# Altium schematic sheet Supply.SchDoc: Supply
size 420 x 297 mm; DocumentNumber: 9; SheetNumber: 6; SheetTotal: 15
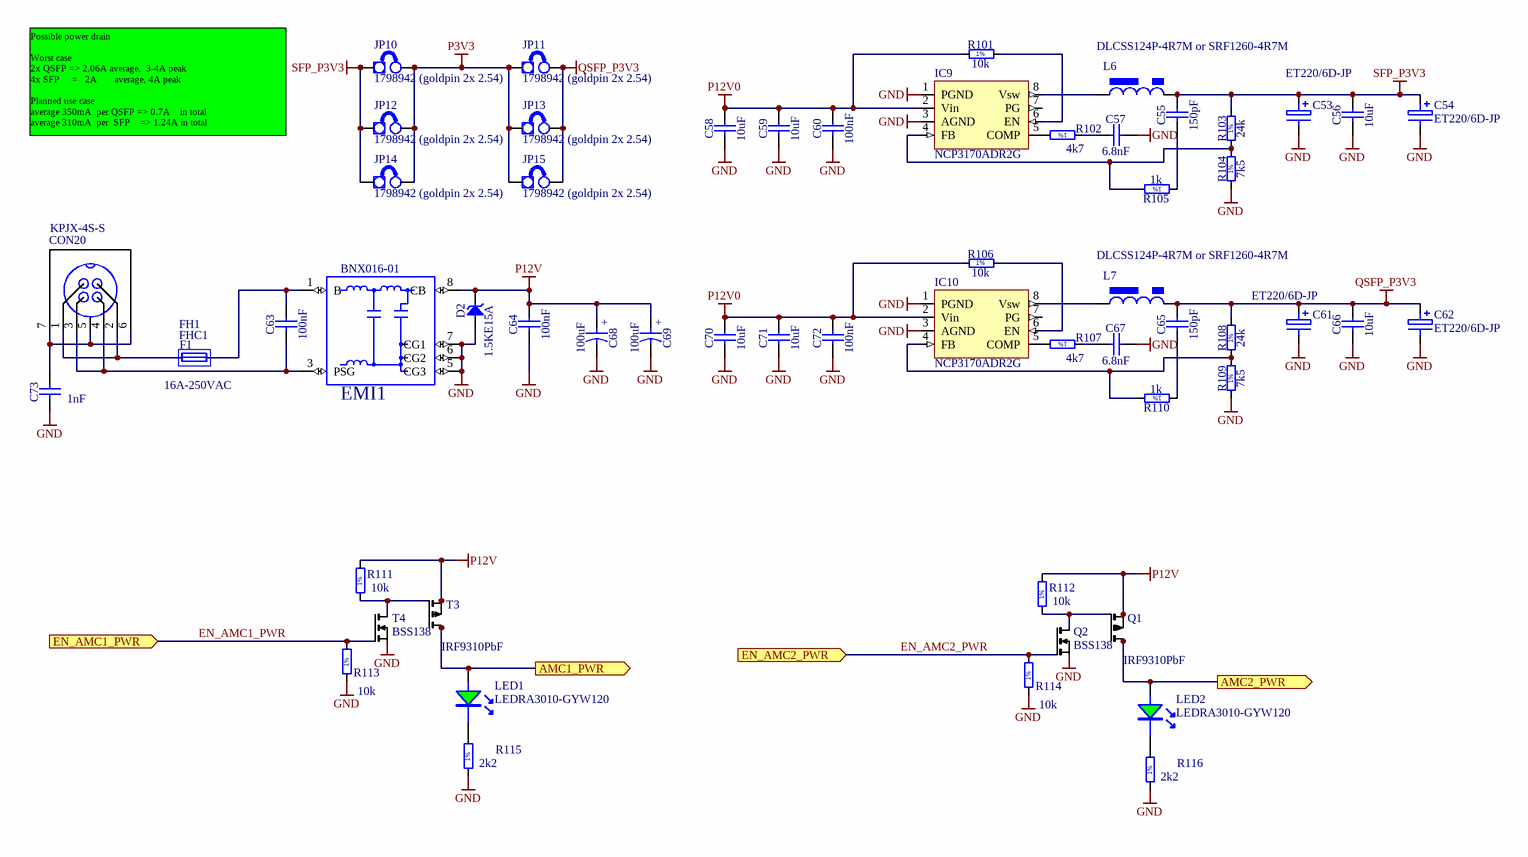
[diagram p0: Supply.SchDoc]

## Parts
C53  ET220/6D-JP  [2917_SMDD]
C54  ET220/6D-JP  [2917_SMDD]
C55  150pF  [CAPC1608X87N]
C56  10uF  [CAPC2012X135N]
C57  6.8nF  [CAPC1608X87N]
C58  10uF  [CAPC3216X140N]
C59  10uF  [CAPC3216X140N]
C60  100nF  [CAPC1005X55N]
C61  ET220/6D-JP  [2917_SMDD]
C62  ET220/6D-JP  [2917_SMDD]
C63  100nF  [CAPC1005X55N]
C64  100nF  [CAPC1005X55N]
C65  150pF  [CAPC1608X87N]
C66  10uF  [CAPC2012X135N]
C67  6.8nF  [CAPC1608X87N]
C68  100uF  [CAPMP7343X430N]
C69  100uF  [CAPMP7343X430N]
C70  10uF  [CAPC3216X140N]
C71  10uF  [CAPC3216X140N]
C72  100nF  [CAPC1005X55N]
C73  1nF  [CAPC3216X140N]
CON20  KPJX-4S-S  [CON_KPJX-4S-S]
D2  1.5KE15A  [VISHAY_1.5KE]
EMI1  BNX016-01  [BNX016-01]
F1  16A-250VAC  [FUSE_5X20_GLASS_h]
FH1  Fuse Holder  [FUSH_SCHURTER_OGN]  (value not drawn)
FHC1  Fuse Holder Cover No Pin  [FUSHC_SCHURTER_0853.0551]  (value not drawn)
IC9  NCP3170ADR2G  [so-8]
IC10  NCP3170ADR2G  [so-8]
JP10  1798942 (goldpin 2x 2.54)  [HEADER2x1 2.54mm]
JP11  1798942 (goldpin 2x 2.54)  [HEADER2x1 2.54mm]
JP12  1798942 (goldpin 2x 2.54)  [HEADER2x1 2.54mm]
JP13  1798942 (goldpin 2x 2.54)  [HEADER2x1 2.54mm]
JP14  1798942 (goldpin 2x 2.54)  [HEADER2x1 2.54mm]
JP15  1798942 (goldpin 2x 2.54)  [HEADER2x1 2.54mm]
L6  DLCSS124P-4R7M or SRF1260-4R7M  [choke_DLCSS124]
L7  DLCSS124P-4R7M or SRF1260-4R7M  [choke_DLCSS124]
LED1  LEDRA3010-GYW120  [LED_KPA3010_G]
LED2  LEDRA3010-GYW120  [LED_KPA3010_G]
Q1  IRF9310PbF  [so-8]
Q2  BSS138  [SOT95P251X112-3N]
R101  10k  [RESC1005X40N]
R102  4k7  [RESC1005X40N]
R103  24k  [RESC1608X55N]
R104  7k5  [RESC1608X55N]
R105  1k  [RESC1005X40N]
R106  10k  [RESC1005X40N]
R107  4k7  [RESC1005X40N]
R108  24k  [RESC1608X55N]
R109  7k5  [RESC1608X55N]
R110  1k  [RESC1005X40N]
R111  10k  [RESC1005X40N]
R112  10k  [RESC1005X40N]
R113  10k  [RESC1005X40N]
R114  10k  [RESC1005X40N]
R115  2k2  [RESC1005X40N]
R116  2k2  [RESC1005X40N]
T3  IRF9310PbF  [so-8]
T4  BSS138  [SOT95P251X112-3N]

## Ports
AMC1_PWR (out), AMC2_PWR (out), EN_AMC1_PWR (in), EN_AMC2_PWR (in)

## Nets
GND: C53.2 C54.2 C56.1 C57.2 C58.1 C59.1 C60.1 C61.2 C62.2 C64.1 C66.1 C67.2 C68.2 C69.2 C70.1 C71.1 C72.1 C73.1 D2.2(A) EMI1.5(CG3) EMI1.6(CG2) EMI1.7(CG1) IC9.1(PGND) IC9.3(AGND) IC10.1(PGND) IC10.3(AGND) Q2.2(S) R104.1 R109.1 R113.1 R114.1 R115.1 R116.1 T4.2(S)
P3V3: JP10.2(E2) JP11.1(E1) JP12.2(E2) JP13.1(E1) JP14.2(E2) JP15.1(E1)
P12V: C64.2 C68.1 C69.1 D2.1(C) EMI1.8(CB) Q1.1(S1) Q1.2(S1) Q1.3(S1) R111.2 R112.2 T3.1(S1) T3.2(S1) T3.3(S1)
P12V0: C58.2 C59.2 C60.2 C70.2 C71.2 C72.2 IC9.2(Vin) IC10.2(Vin) R101.1 R106.1
QSFP_P3V3: C61.1 C62.1 C65.2 C66.2 JP11.2(E2) JP13.2(E2) JP15.2(E2) L7.2 R108.2
SFP_P3V3: C53.1 C54.1 C55.2 C56.2 JP10.1(E1) JP12.1(E1) JP14.1(E1) L6.2 R103.2
AMC1_PWR: LED1.A T3.5(D1) T3.6(D1) T3.7(D1) T3.8(D1) ; port AMC1_PWR
AMC2_PWR: LED2.A Q1.5(D1) Q1.6(D1) Q1.7(D1) Q1.8(D1) ; port AMC2_PWR
EN_AMC1_PWR: R113.2 T4.1(G) ; port EN_AMC1_PWR
EN_AMC2_PWR: Q2.1(G) R114.2 ; port EN_AMC2_PWR
NetC55_1: C55.1 R105.1
NetC57_1: C57.1 R102.1
NetC63_1: C63.1 CON20.3 CON20.4 EMI1.3(PSG)
NetC63_2: C63.2 EMI1.1(B) FH1.2
NetC65_1: C65.1 R110.1
NetC67_1: C67.1 R107.1
NetC73_2: C73.2 CON20.5 CON20.6 CON20.7
NetCON20_1: CON20.1 CON20.2 FH1.1
NetIC9_4: IC9.4(FB) R103.1 R104.2 R105.2
NetIC9_5: IC9.5(COMP) R102.2
NetIC9_6: IC9.6(EN) R101.2
NetIC9_8: IC9.8(Vsw) L6.1
NetIC10_4: IC10.4(FB) R108.1 R109.2 R110.2
NetIC10_5: IC10.5(COMP) R107.2
NetIC10_6: IC10.6(EN) R106.2
NetIC10_8: IC10.8(Vsw) L7.1
NetLED1_K: LED1.K R115.2
NetLED2_K: LED2.K R116.2
NetQ1_4: Q1.4(G1) Q2.3(D) R112.1
NetR111_1: R111.1 T3.4(G1) T4.3(D)

Not connected (* = marked no-connect by the designer): IC9 7(PG); IC10 7(PG)

## Notes on the sheet
- Possible power drain
  Worst case
  2x QSFP => 2.06A average,  3-4A peak
  4x SFP     =   2A       average, 4A peak
  Planned use case
  average 350mA  per QSFP => 0.7A    in total
  average 310mA  per  SFP    => 1.24A in total
- Project/Equipment
- Document
- uTCA RTM 8 SFP+
- Designer
- Drawn by
- Check.by
- Copyright Creotech Instruments SA 2014.
  This documentation describes Open Hardware and is licensed under the CERN OHL v.1.1. You may redistribute and modify this documentation under the terms of the CERN OHL v.1.1. (http://ohwr.org/CERNOHL). This documentation is distributed WITHOUT ANY EXPRESS OR IMPLIED WARRANTY, INCLUDING OF MERCHANTABILITY, SATISFACTORY QUALITY AND FITNESS FOR A PARTICULAR PURPOSE. Please see the CERN OHL v.1.1 for applicable conditions.
- Creotech Instruments S.A.
- File
- Last Mod.
- Print Date
- Sheet
- Size
- A3
- of
- Rev
- (in symbol CTE7343-43_100UF_20V_10%_LESR0150) +
- (in symbol R0402_1K_1%_0.0625W_100PPM) 1%
- (in symbol R0402_2K2_1%_0.0625W_100PPM) 1%
- (in symbol R0402_4K7_1%_0.0625W_100PPM) 1%
- (in symbol R0402_10K_1%_0.0625W_100PPM) 1%
- (in symbol R0603_7K5_1%_0.1W_100PPM) 1%
- (in symbol R0603_24K_1%_0.1W_100PPM) 1%

## Library data of the parts
C53 C54 C61 C62 = CAP_TANTALIUM: Tantalium Capacitor
C55 C65 = CC0603_150PF_50V_5%_NP0: Non-polarised capacitor; Part Description: SMD Multilayer Chip Ceramic Capacitor; Manufacturer: GENERIC; Manufacturer1 Part Number: 223886715151; Voltage: 50V; TC: NP0; Tolerance: ±5%; Table: Capacitors SMD; Part Number: CC0603_150PF_50V_5%_NP0; Component Kind: Standard; Component Type: Standard; Pin Count: 2; Value: 150pF; Status: Preferred; Manufacturer Part Number: CC0603_150PF_50V_5%_NP0; Case: 0603; Mounted: Yes; Socket: No; SMD: Yes; Manufacturer1 Example: PHYCOMP; Manufacturer1 ComponentHeight: 0.87mm; HelpURL: \\cern.ch\dfs\Applications\Altium\Datasheets\CC0603_NP0_PHYCOMP.pdf; Author: CERN DEM JLC; CreateDate: 2007-12-03; LatestRevisionDate: 2007-12-03
C56 C66 = CC0805_10UF_10V_10%_X7R: Non-polarised capacitor; Part Description: SMD Multilayer Chip Ceramic Capacitor; Manufacturer: GENERIC; Manufacturer1 Part Number: GRM21BR71A106KE51L; Voltage: 10V; TC: X7R; Tolerance: ±10%; Table: Capacitors SMD; Part Number: CC0805_10UF_10V_10%_X7R; Component Kind: Standard; Component Type: Standard; Pin Count: 2; Value: 10uF; Status: Preferred; Manufacturer Part Number: CC0805_10UF_10V_10%_X7R; Case: 0805; Mounted: Yes; Socket: No; SMD: Yes; Manufacturer1 Example: MURATA; Manufacturer1 ComponentHeight: 1.35mm; HelpURL: \\cern.ch\dfs\Applications\Altium\Datasheets\CC0805_X7R_MURATA.pdf; Author: CERN DEM JLC; CreateDate: 2012-04-30; LatestRevisionDate: 2012-04-30
C57 C67 = CC0603_6.8NF_50V_5%_C0G: Non-polarised capacitor; Part Description: SMD Multilayer Chip Ceramic Capacitor; Manufacturer: GENERIC; Manufacturer1 Part Number: C0603C682J5GACTU; Voltage: 50V; TC: C0G; Tolerance: ±5%; Table: Capacitors SMD; Part Number: CC0603_6.8NF_50V_5%_C0G; Component Kind: Standard; Component Type: Standard; Pin Count: 2; Value: 6.8nF; Status: Preferred; Manufacturer Part Number: CC0603_6.8NF_50V_5%_C0G; Case: 0603; Mounted: Yes; Socket: No; SMD: Yes; Manufacturer1 Example: KEMET; Manufacturer1 ComponentHeight: 0.87mm; HelpURL: \\cern.ch\dfs\Applications\Altium\Datasheets\CC0603_C0G_KEMET.pdf; Author: CERN DEM JLC; CreateDate: 2013-10-01; LatestRevisionDate: 2013-10-01
C58 C59 C70 C71 = CC1206_10UF_16V_10%_X7R: Non-polarised capacitor; Part Description: SMD Multilayer Chip Ceramic Capacitor; Manufacturer: GENERIC; Manufacturer1 Part Number: C1206C106K4RAC; Voltage: 16V; TC: X7R; Tolerance: ±10%; Table: Capacitors SMD; Part Number: CC1206_10UF_16V_10%_X7R; Component Kind: Standard; Component Type: Standard; Pin Count: 2; Value: 10uF; Status: Preferred; Manufacturer Part Number: CC1206_10uF_16V_10%_X7R; Case: 1206; Mounted: Yes; Socket: No; SMD: Yes; Manufacturer1 Example: KEMET; Manufacturer1 ComponentHeight: 1.8mm; HelpURL: \\cern.ch\dfs\Applications\Altium\Datasheets\CC1206_X7R_KEMET.pdf; Author: CERN DEM JLC; CreateDate: 2009-04-28; LatestRevisionDate: 2009-04-28
C60 C63 C64 C72 = CC0402_100NF_16V_10%_X5R: Non-polarised capacitor; Part Description: SMD Multilayer Chip Ceramic Capacitor; Manufacturer: GENERIC; Manufacturer1 Part Number: GRM155R61C104KA88D; Voltage: 16V; TC: X5R; Tolerance: ±10%; Table: Capacitors SMD; Part Number: CC0402_100NF_16V_10%_X5R; Component Kind: Standard; Component Type: Standard; Pin Count: 2; Value: 100nF; Status: None; Manufacturer Part Number: CC0402_100NF_16V_10%_X5R; Case: 0402; Mounted: Yes; Socket: No; SMD: Yes; Manufacturer1 Example: MURATA; Manufacturer1 ComponentHeight: 0.55mm; HelpURL: \\cern.ch\dfs\Applications\Altium\Datasheets\CC0402_X5R_MURATA_GRM.pdf; Author: CERN DEM JLC; CreateDate: 2013-12-10; LatestRevisionDate: 2013-12-10
C68 C69 = CTE7343-43_100UF_20V_10%_LESR0150: Polarised capacitor; Part Description: Low ESR 0R15 Solid Tantalum Chip Capacitor; Manufacturer: GENERIC; Manufacturer1 Part Number: TPSE107K020R0150; Voltage: 20V; Tolerance: ±10%; Table: Capacitors SMD; Part Number: CTE7343-43_100UF_20V_10%_LESR0150; Component Kind: Standard; Component Type: Standard; Pin Count: 2; Value: 100uF; Status: Preferred; Manufacturer Part Number: CTE7343-43_100UF_20V_10%_LESR0150; Case: E; Mounted: Yes; Socket: No; SMD: Yes; Manufacturer1 Example: AVX; Manufacturer1 ComponentHeight: 4.3mm; HelpURL: \\cern.ch\dfs\Applications\Altium\Datasheets\CTE-LESR_AVX_TPS.pdf; Author: CERN DEM JLC; CreateDate: 2008-05-05; LatestRevisionDate: 2009-01-20
C73 = CC1206_1NF_100V_5%_NP0: Non-polarised capacitor; Part Description: SMD Multilayer Chip Ceramic Capacitor; Manufacturer: GENERIC; Manufacturer1 Part Number: 12061A102JAT2A; Voltage: 100V; TC: NP0; Tolerance: ±5%; Table: Capacitors SMD; Part Number: CC1206_1NF_100V_5%_NP0; Component Kind: Standard; Component Type: Standard; Pin Count: 2; Value: 1nF; Status: Preferred; Manufacturer Part Number: CC1206_1NF_100V_5%_NP0; Case: 1206; Mounted: Yes; Socket: No; SMD: Yes; Manufacturer1 Example: AVX; Manufacturer1 ComponentHeight: 0.94mm; HelpURL: \\cern.ch\dfs\Applications\Altium\Datasheets\CC1206_NP0_AVX.pdf; Author: CERN DEM JLC; CreateDate: 2011-04-06; LatestRevisionDate: 2011-04-06
CON20 = CON_DC_7.5A_4pin: 7.5A DC connector
D2 = 1.5KE15A: Transient Voltage Suppressor Diode (Uni-Directional); Part Description: Uni-directional  Transient Voltage Suppressor Diode - TRANSZORB®; Manufacturer: VISHAY GENERAL SEMICONDUCTOR; Voltage: 15V; Power: 1500W; Table: Diodes; Part Number: 1.5KE15A; Component Kind: Standard; Component Type: Standard; Device: 1.5KE15A; PackageDescription: VISHAY 1.5KE Case Style, Diode, Axial; Lead Spacing 20.32mm, Lead Dia. 1.07mm, Body Length 9.5mm, Body Dia. 5.3mm; Manufacturer Part Number: 1.5KE15A; Pin Count: 2; Mounted: Yes; Socket: No; SMD: No; ComponentHeight: 5.3mm; HelpURL: \\cern.ch\dfs\Applications\Altium\Datasheets\1.5KE.pdf; Author: CERN DEM JLC; CreateDate: 2012-12-11; LatestRevisionDate: 2012-12-11
EMI1 = L_CMC_BNX016-01.1: FILTER EMI 50MOHM 15A .1M-1GHZ; PART_TYPE: COMBINED; DXDB_LIBNAME: FILTERS; OWNER: 3709; DIST_P/N: 490-5055-ND; DIST: DIGIKEY; MANF: MURATA; DEVICE: BNX016-01; PKG_TYPE: BNX016-01; MANF_P/N: BNX016-01; DATASHEET: \\XSJ-SMB\AFX\AFX\BOARD_PROJECTS\LIBRARY\\DATASHEETS\FILTER\L0117BNX01.PDF; ROHS: YES; CURRENT: 15A; VALUE: 50MOHM
F1 = FUSE_SCHURTER_0034.3129_h: Fuse; Part Description: Cylindrical 5x20 mm, Time-Lag T Miniature Fuse, FST Serie; Table: Fuses; Part Number: FUSE_SCHURTER_0034.3129_h; Component Kind: Standard; Component Type: Standard; Pin Count: 0; PackageDescription: 5x20mm Cylindrical Fuse, SCHURTER FST5X20 Serie; Family: Fuse; Mounted: Yes; Socket: Yes; SMD: No; Value: 16A-250VAC; Manufacturer: SCHURTER; Manufacturer Part Number: 0034.3129; ComponentHeight: 5.2mm; HelpURL: \\cern.ch\dfs\Applications\Altium\Datasheets\FUSE_SCHURTER_FST5X20.pdf; Author: CERN DEM JLC; CreateDate: 2013-01-28; LatestRevisionDate: 2013-01-28
FH1 = FUSH_SCHURTER-OGN_0031.8211: Part Description: Fuse holder for 5x20mm Fuses; Table: Fuses; Part Number: FUSH_SCHURTER-OGN_0031.8211; Component Kind: Standard; Component Type: Standard; Pin Count: 2; PackageDescription: SCHURTER OGN Series, Fuse holder for 5x20mm Fuses; Family: Fuse Holder; Mounted: Yes; Socket: No; SMD: No; Manufacturer: SCHURTER; Manufacturer Part Number: 0031.8211; ComponentHeight: 11.5mm; HelpURL: \\cern.ch\dfs\Applications\Altium\Datasheets\FUSH_SCHURTER_OGN.pdf; Author: CERN DEM JLC; CreateDate: 2008-06-03; LatestRevisionDate: 2008-07-02
FHC1 = FUSHC_SCHURTER_0853.0551: Part Description: Cover for Fuse Holder OGN, OGN-SMD; Table: Fuses; Part Number: FUSHC_SCHURTER_0853.0551; Component Kind: Standard; Component Type: Standard; Pin Count: 0; PackageDescription: Cover for Fuse Holder OGN, OGN-SMD; Family: Fuse Holder Cover; Mounted: Yes; Socket: No; SMD: No; Manufacturer: SCHURTER; Manufacturer Part Number: 0853.0551; ComponentHeight: 12.5mm; HelpURL: \\cern.ch\dfs\Applications\Altium\Datasheets\FUSHC_SCHURTER_0853.0551.pdf; Author: CERN DEM JLC; CreateDate: 2013-03-06; LatestRevisionDate: 2013-03-06
IC9 IC10 = PWM_NCP3170: 4.5V to 18V, 3A synch buck
JP10-JP15 = JUMPER: Supplier 1: Farnell; Supplier Part Number 1: 1798942
L6 L7 = L_POWER_CSS124_6.8uH: Shielded Ferrite base SMD Power Choke DLCSS124P Series 4.7uH, 20%, 5.7A, 0.018R, 750pcs/reel
LED1 LED2 = LED_SMD_90deg_G: LED (Maritex); Supplier 1: Farnell; Supplier Part Number 1: 8530335RL
Q1 T3 = Q_IRF9310: PMOS 30V, 4.6mR, 20A, 2.5W
Q2 T4 = Q_BSS138
R101 R106 R111-R114 = R0402_10K_1%_0.0625W_100PPM: Resistor - 1%; Part Description: General Purpose Thick Film Chip Resistor; Manufacturer: GENERIC; Manufacturer1 Part Number: 232270671003L; TC: ±100ppm/°C; Table: Resistors SMD; Part Number: R0402_10K_1%_0.0625W_100PPM; Component Kind: Standard; Component Type: Standard; Pin Count: 2; Value: 10k; Status: Not recommended; Power: 0.0625W; Tolerance: ±1%; Manufacturer Part Number: R0402_10K_1%_0.0625W_100PPM; Case: 0402; Mounted: Yes; Socket: No; SMD: Yes; Manufacturer1 Example: YAGEO PHYCOMP; Manufacturer1 ComponentHeight: 0.4mm; HelpURL: \\cern.ch\dfs\Applications\Altium\Datasheets\R0402_Phycomp_RC0402.pdf; Author: CERN DEM JLC; CreateDate: 2007-12-03; LatestRevisionDate: 2012-10-17
R102 R107 = R0402_4K7_1%_0.0625W_100PPM: Resistor - 1%; Part Description: General Purpose Thick Film Chip Resistor; Manufacturer: GENERIC; Manufacturer1 Part Number: 232270674702L; TC: ±100ppm/°C; Table: Resistors SMD; Part Number: R0402_4K7_1%_0.0625W_100PPM; Component Kind: Standard; Component Type: Standard; Pin Count: 2; Value: 4k7; Status: Not recommended; Power: 0.0625W; Tolerance: ±1%; Manufacturer Part Number: R0402_4K7_1%_0.0625W_100PPM; Case: 0402; Mounted: Yes; Socket: No; SMD: Yes; Manufacturer1 Example: YAGEO PHYCOMP; Manufacturer1 ComponentHeight: 0.4mm; HelpURL: \\cern.ch\dfs\Applications\Altium\Datasheets\R0402_Phycomp_RC0402.pdf; Author: CERN DEM JLC; CreateDate: 2007-12-03; LatestRevisionDate: 2012-10-17
R103 R108 = R0603_24K_1%_0.1W_100PPM: Resistor - 1%; Part Description: General Purpose Thick Film Chip Resistor; Manufacturer: GENERIC; Manufacturer1 Part Number: NRC06F2402TRF; Power: 0.1W; TC: ±100ppm/°C; Table: Resistors SMD; Part Number: R0603_24K_1%_0.1W_100PPM; Component Kind: Standard; Component Type: Standard; Pin Count: 2; Value: 24k; Status: Preferred; Tolerance: ±1%; Manufacturer Part Number: R0603_24K_1%_0.1W_100PPM; Case: 0603; Mounted: Yes; Socket: No; SMD: Yes; Manufacturer1 Example: NIC COMPONENT; Manufacturer1 ComponentHeight: 0.55mm; HelpURL: \\cern.ch\dfs\Applications\Altium\Datasheets\R0603_NIC_NRC.pdf; Author: CERN DEM JLC; CreateDate: 2007-12-03; LatestRevisionDate: 2008-03-13
R104 R109 = R0603_7K5_1%_0.1W_100PPM: Resistor - 1%; Part Description: General Purpose Thick Film Chip Resistor; Manufacturer: GENERIC; Manufacturer1 Part Number: NRC06F7501TRF; Power: 0.1W; TC: ±100ppm/°C; Table: Resistors SMD; Part Number: R0603_7K5_1%_0.1W_100PPM; Component Kind: Standard; Component Type: Standard; Pin Count: 2; Value: 7k5; Status: Preferred; Tolerance: ±1%; Manufacturer Part Number: R0603_7K5_1%_0.1W_100PPM; Case: 0603; Mounted: Yes; Socket: No; SMD: Yes; Manufacturer1 Example: NIC COMPONENT; Manufacturer1 ComponentHeight: 0.55mm; HelpURL: \\cern.ch\dfs\Applications\Altium\Datasheets\R0603_NIC_NRC.pdf; Author: CERN DEM JLC; CreateDate: 2007-12-03; LatestRevisionDate: 2008-03-13
R105 R110 = R0402_1K_1%_0.0625W_100PPM: Resistor - 1%; Part Description: General Purpose Thick Film Chip Resistor; Manufacturer: GENERIC; Manufacturer1 Part Number: 232270671002L; TC: ±100ppm/°C; Table: Resistors SMD; Part Number: R0402_1K_1%_0.0625W_100PPM; Component Kind: Standard; Component Type: Standard; Pin Count: 2; Value: 1k; Status: Not recommended; Power: 0.0625W; Tolerance: ±1%; Manufacturer Part Number: R0402_1K_1%_0.0625W_100PPM; Case: 0402; Mounted: Yes; Socket: No; SMD: Yes; Manufacturer1 Example: YAGEO PHYCOMP; Manufacturer1 ComponentHeight: 0.4mm; HelpURL: \\cern.ch\dfs\Applications\Altium\Datasheets\R0402_Phycomp_RC0402.pdf; Author: CERN DEM JLC; CreateDate: 2007-12-03; LatestRevisionDate: 2012-10-17
R115 R116 = R0402_2K2_1%_0.0625W_100PPM: Resistor - 1%; Part Description: General Purpose Thick Film Chip Resistor; Manufacturer: GENERIC; Manufacturer1 Part Number: 232270672202L; TC: ±100ppm/°C; Table: Resistors SMD; Part Number: R0402_2K2_1%_0.0625W_100PPM; Component Kind: Standard; Component Type: Standard; Pin Count: 2; Value: 2k2; Status: Not recommended; Power: 0.0625W; Tolerance: ±1%; Manufacturer Part Number: R0402_2K2_1%_0.0625W_100PPM; Case: 0402; Mounted: Yes; Socket: No; SMD: Yes; Manufacturer1 Example: YAGEO PHYCOMP; Manufacturer1 ComponentHeight: 0.4mm; HelpURL: \\cern.ch\dfs\Applications\Altium\Datasheets\R0402_Phycomp_RC0402.pdf; Author: CERN DEM JLC; CreateDate: 2007-12-03; LatestRevisionDate: 2012-10-17